# Altium schematic sheet HC_OUTPUTS.SchDoc
size A
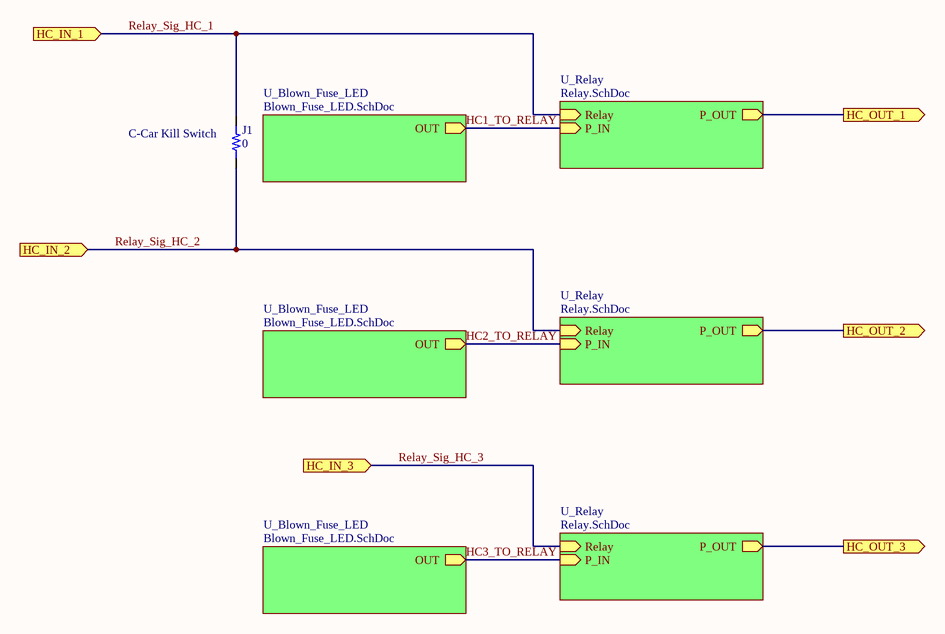
[diagram p0: HC_OUTPUTS.SchDoc]

## Parts
J1  value 0  [RES 0603/1608]  (hidden comment: Resistor 1.0 0603 1/10W 10%)

## Sub-sheets
U_Blown_Fuse_LED = Blown_Fuse_LED.SchDoc: OUT (out)
U_Blown_Fuse_LED = Blown_Fuse_LED.SchDoc: OUT (out)
U_Blown_Fuse_LED = Blown_Fuse_LED.SchDoc: OUT (out)
U_Relay = Relay.SchDoc: Relay (in), P_OUT (out), P_IN (in)
U_Relay = Relay.SchDoc: Relay (in), P_OUT (out), P_IN (in)
U_Relay = Relay.SchDoc: Relay (in), P_OUT (out), P_IN (in)

## Ports
HC_IN_1 (in), HC_IN_2 (in), HC_IN_3 (in), HC_OUT_1 (out), HC_OUT_2 (out), HC_OUT_3 (out)

## Nets
HC1_TO_RELAY: sheet U_Blown_Fuse_LED/OUT, sheet U_Relay/P_IN
HC2_TO_RELAY: sheet U_Blown_Fuse_LED/OUT, sheet U_Relay/P_IN
HC3_TO_RELAY: sheet U_Blown_Fuse_LED/OUT, sheet U_Relay/P_IN
HC_OUT_1: port HC_OUT_1, sheet U_Relay/P_OUT
HC_OUT_2: port HC_OUT_2, sheet U_Relay/P_OUT
HC_OUT_3: port HC_OUT_3, sheet U_Relay/P_OUT
Relay_Sig_HC_1: J1.1 ; port HC_IN_1, sheet U_Relay/Relay
Relay_Sig_HC_2: J1.2 ; port HC_IN_2, sheet U_Relay/Relay
Relay_Sig_HC_3: port HC_IN_3, sheet U_Relay/Relay

## Notes on the sheet
- (near J1) C-Car Kill Switch

## Library data of the parts
J1 = 2269: Manufacturer_id: 1; idResistor: 2269; Name: Res_1.0_0603_1/10W_10%; Created_By: Nick Mah; Supplier 1: Digi-Key; Drawer_id: 1; Tolerance: 10%; Power: 1/10W; Package: 0603; ComponentLink1Description: Datasheet; Created_Date: 2018-10-20